# EAGLE design hijack-fram_B (EAGLE 6.2)
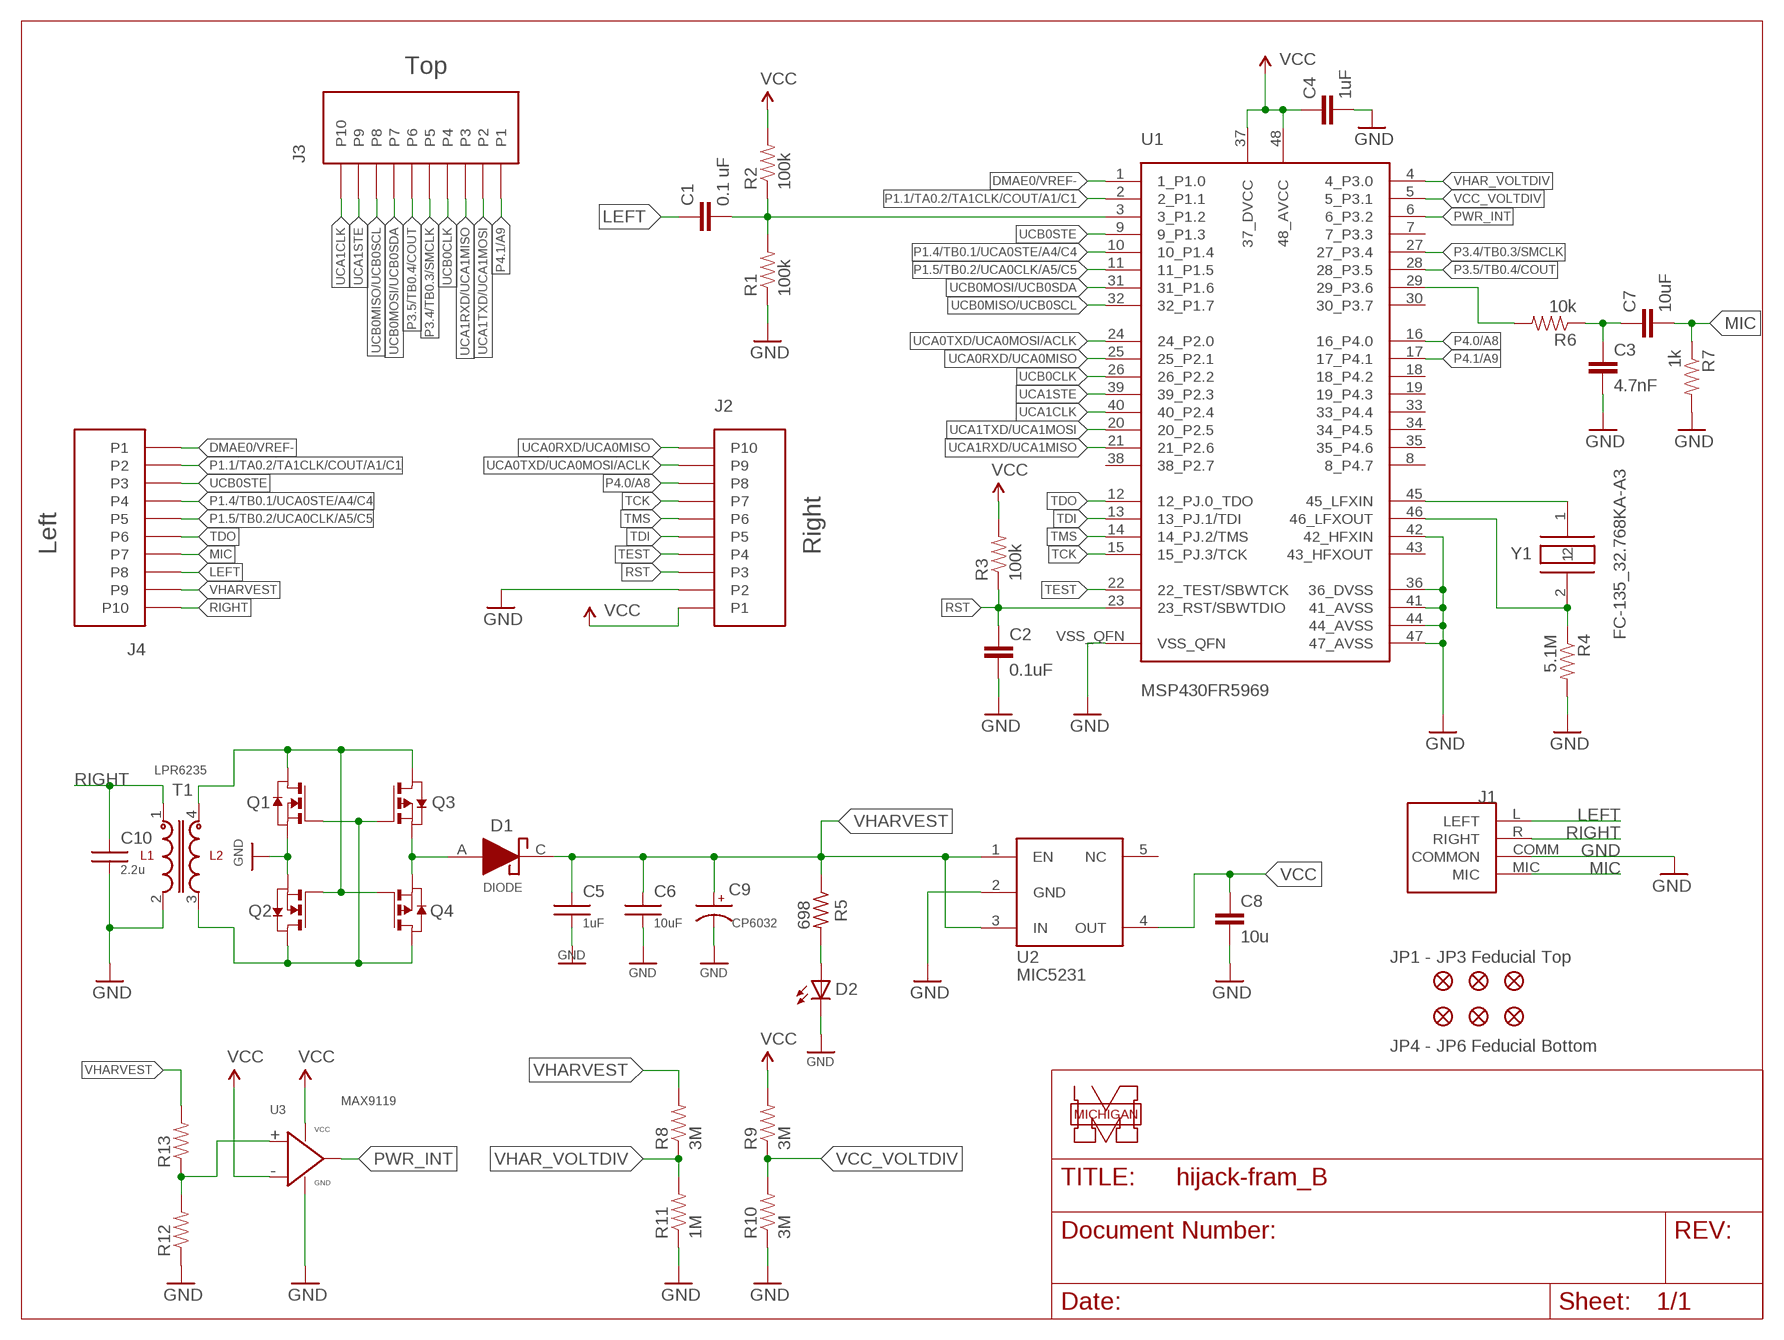
[diagram p0: schematic, sheet 1]

## Parts
C1  0.1 uF  CAP0603-CAP  [0603-CAP]
C2  0.1uF  CAP0603-CAP  [0603-CAP]
C3  4.7nF  CAP0603-CAP  [0603-CAP]
C4  1uF  CAP0603-CAP  [0603-CAP]
C5  1uF  C0603  [C0603]
C6  10uF  C0603  [C0603]
C7  10uF  CAP0603-CAP  [0603-CAP]
C8  10u  C-EUC0603  [C0603]
C9  CP6032  [CT6032]
C10  2.2u  C0603  [C0603]
D1  DIODE  [MINIMELF]
D2  LED0603  [LED-0603]
J1  3.5JACK4CONNSUNSTONE_QUICKTURN  [PLUGBOARDCONNECTOR_SUNSTONE]
J2  HEADER10POS  [10PIN2MMHEADER]
J3  HEADER10POS  [10PIN2MMHEADER]
J4  HEADER10POS  [10PIN2MMHEADER]
JP1  FIDUCIAL1X2  [FIDUCIAL-1X2]
JP2  FIDUCIAL1X2  [FIDUCIAL-1X2]
JP3  FIDUCIAL1X2  [FIDUCIAL-1X2]
JP4  FIDUCIAL1X2  [FIDUCIAL-1X2]
JP5  FIDUCIAL1X2  [FIDUCIAL-1X2]
JP6  FIDUCIAL1X2  [FIDUCIAL-1X2]
Q1  NMOSSOT23  [SOT-23]
Q2  NMOSSOT23  [SOT-23]
Q3  PMOSSOT23  [SOT-23]
Q4  PMOSSOT23  [SOT-23]
R1  100k  RESISTOR0603-RES  [0603-RES]
R2  100k  RESISTOR0603-RES  [0603-RES]
R3  100k  RESISTOR0603-RES  [0603-RES]
R4  5.1M  RESISTOR0603-RES  [0603-RES]
R5  698  R-US_R0603  [R0603]
R6  10k  RESISTOR0603-RES  [0603-RES]
R7  1k  RESISTOR0603-RES  [0603-RES]
R8  3M  RESISTOR0603-RES  [0603-RES]
R9  3M  RESISTOR0603-RES  [0603-RES]
R10  3M  RESISTOR0603-RES  [0603-RES]
R11  1M  RESISTOR0603-RES  [0603-RES]
R12  RESISTOR0603-RES  [0603-RES]
R13  RESISTOR0603-RES  [0603-RES]
T1  LPR6235  [LPR6235]
U1  MSP430FR5969  [RGZ(S-PQFP-N48)]
U2  MIC5231  [SOT23-5]
U3  MAX9119  [SC70-5]
Y1  FC-135_32.768KA-A3  [FC-135]

## Nets
DMAE0/VREF-: J4.P1 U1.1(1_P1.0)
GND: C2.2 C3.2 C4.2 C5.2 C6.2 C8.2 C9.- C10.2 D2.C J1.COMM(COMMON) J2.P2 Q1.2(S) Q2.2(S) R1.1 R4.2 R7.2 R10.1 R11.1 R12.1 T1.2 U1.36(36_DVSS) U1.41(41_AVSS) U1.42(42_HFXIN) U1.44(44_AVSS) U1.47(47_AVSS) U1.VSS_QFN U2.2(GND) U3.2(GND)
LEFT: C1.1 J1.L(LEFT) J4.P8
MIC: C7.2 J1.MIC J4.P7 R7.1
N$1: C1.2 R1.2 R2.1 U1.3(3_P1.2)
N$2: R4.1 U1.46(46_LFXOUT) Y1.2
N$3: R6.2 U1.29(29_P3.6)
N$6: R12.2 R13.1 U3.3(IN+)
N$7: U1.45(45_LFXIN) Y1.1
N$8: Q1.1(D) Q2.3(G) Q3.1(D) Q4.3(G) T1.4
N$9: Q1.3(G) Q2.1(D) Q3.3(G) Q4.1(D) T1.3
N$11: D2.A R5.2
N$12: C3.1 C7.1 R6.1
N$17: D1.A Q3.2(S) Q4.2(S)
P1.1/TA0.2/TA1CLK/COUT/A1/C1: J4.P2 U1.2(2_P1.1)
P1.4/TB0.1/UCA0STE/A4/C4: J4.P4 U1.10(10_P1.4)
P1.5/TB0.2/UCA0CLK/A5/C5: J4.P5 U1.11(11_P1.5)
P3.4/TB0.3/SMCLK: J3.P5 U1.27(27_P3.4)
P3.5/TB0.4/COUT: J3.P6 U1.28(28_P3.5)
P4.0/A8: J2.P8 U1.16(16_P4.0)
P4.1/A9: J3.P1 U1.17(17_P4.1)
PWR_INT: U1.6(6_P3.2) U3.1(OUT)
RIGHT: C10.1 J1.R(RIGHT) J4.P10 T1.1
RST: C2.1 J2.P3 R3.1 U1.23(23_RST/SBWTDIO)
TCK: J2.P7 U1.15(15_PJ.3/TCK)
TDI: J2.P5 U1.13(13_PJ.1/TDI)
TDO: J4.P6 U1.12(12_PJ.0_TDO)
TEST: J2.P4 U1.22(22_TEST/SBWTCK)
TMS: J2.P6 U1.14(14_PJ.2/TMS)
UCA0RXD/UCA0MISO: J2.P10 U1.25(25_P2.1)
UCA0TXD/UCA0MOSI/ACLK: J2.P9 U1.24(24_P2.0)
UCA1CLK: J3.P10 U1.40(40_P2.4)
UCA1RXD/UCA1MISO: J3.P3 U1.21(21_P2.6)
UCA1STE: J3.P9 U1.39(39_P2.3)
UCA1TXD/UCA1MOSI: J3.P2 U1.20(20_P2.5)
UCB0CLK: J3.P4 U1.26(26_P2.2)
UCB0MISO/UCB0SCL: J3.P8 U1.32(32_P1.7)
UCB0MOSI/UCB0SDA: J3.P7 U1.31(31_P1.6)
UCB0STE: J4.P3 U1.9(9_P1.3)
VCC: C4.1 C8.1 J2.P1 R2.2 R3.2 R9.2 U1.37(37_DVCC) U1.48(48_AVCC) U2.4(OUT) U3.4(IN-) U3.5(VCC)
VCC_VOLTDIV: R9.1 R10.2 U1.5(5_P3.1)
VHAR_VOLTDIV: R8.1 R11.2 U1.4(4_P3.0)
VHARVEST: C5.1 C6.1 C9.+ D1.C J4.P9 R5.1 R8.2 R13.2 U2.1(EN) U2.3(IN)
Unconnected: U1.7(7_P3.3) U1.8(8_P4.7) U1.18(18_P4.2) U1.19(19_P4.3) U1.30(30_P3.7) U1.33(33_P4.4) U1.34(34_P4.5) U1.35(35_P4.6) U1.38(38_P2.7) U1.43(43_HFXOUT) U2.5(NC)

## Notes on the sheet
- Top
- Left | Right
- JP1 - JP3 Feducial Top
- JP4 - JP6 Feducial Bottom
- MICHIGAN

## Library data of the parts
C1-C4 C7 = SparkFun:CAP: Capacitor Standard 0603 ceramic capacitor, and 0.1" leaded capacitor.
C5 C6 C10 = umich:C
C8 = rcl:C-EU: CAPACITOR, European symbol
C9 = umich:CP
D1 = umich:DIODE
D2 = umich:LED: LEDs Standard schematic elements and footprints for 5mm, 3mm, 1206, and 0603 sized LEDs. 5mm - Spark Fun Electronics SKU : COM-00529 (and others)
J1 = Thomas:3.5JACK4CONN
J2-J4 = hijack:HEADER10POS: Fits 3M 950510-6102-AR
JP1-JP6 = SparkFun:FIDUCIAL: Fiducial Alignment Points Various fiducial points for machine vision alignment.
Q1 Q2 = zetex:NMOSSOT23: MOS FET
Q3 Q4 = zetex:PMOSSOT23: MOS FET
R1-R4 R6-R13 = SparkFun:RESISTOR: Resistor Basic schematic elements and footprints for 0603, 1206, and PTH 1/10th watt (small) resistors.
R5 = rcl:R-US_: RESISTOR, American symbol
T1 = umich:LPR6235
U1 = hijack:MSP430FR5969
U2 = berkeley-epic:MIC5231
U3 = hijack:MAX9119
Y1 = berkeley-epic:FC-135_32.768KA-A3

## Board
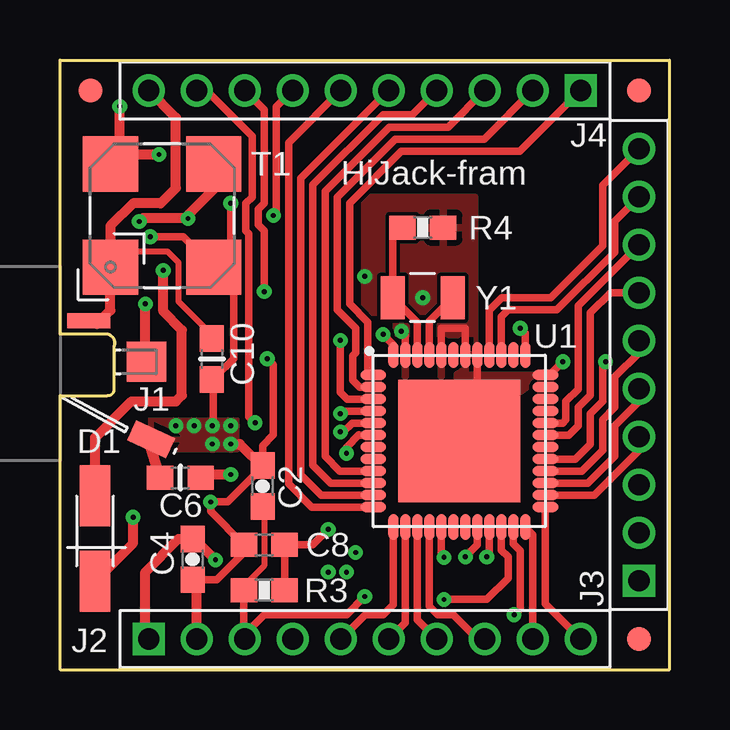
[diagram p1: board, top side]
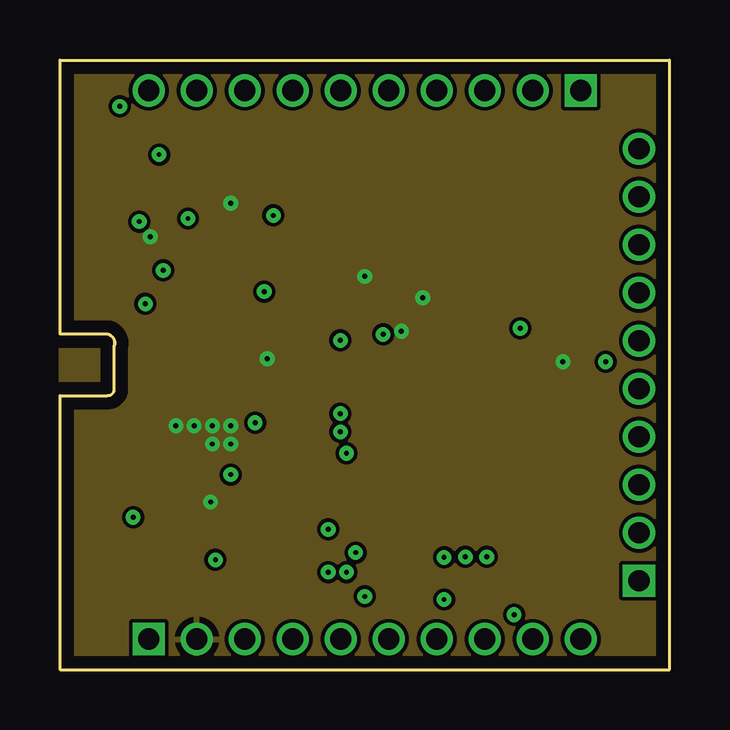
[diagram p2: board, inner layer GND$]
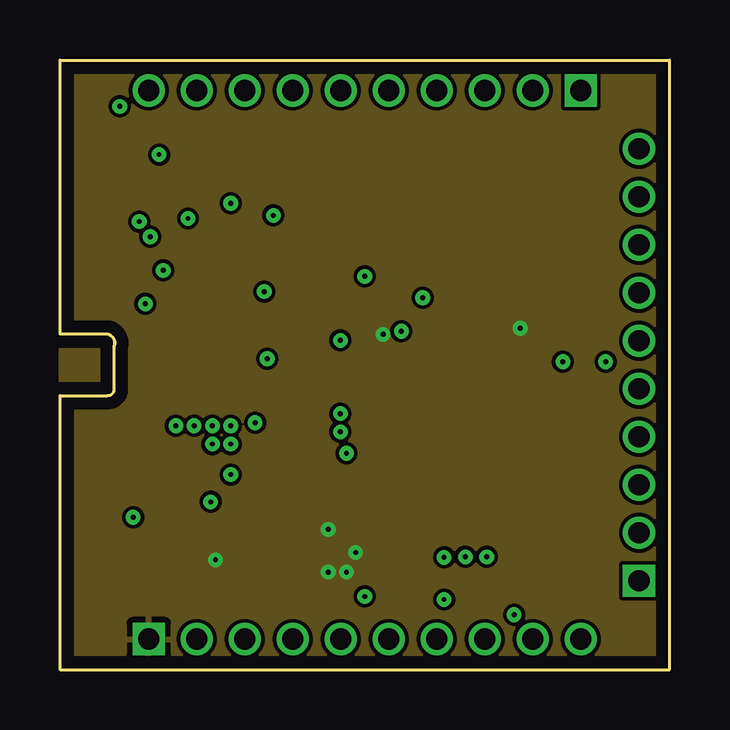
[diagram p3: board, inner layer VCC$]
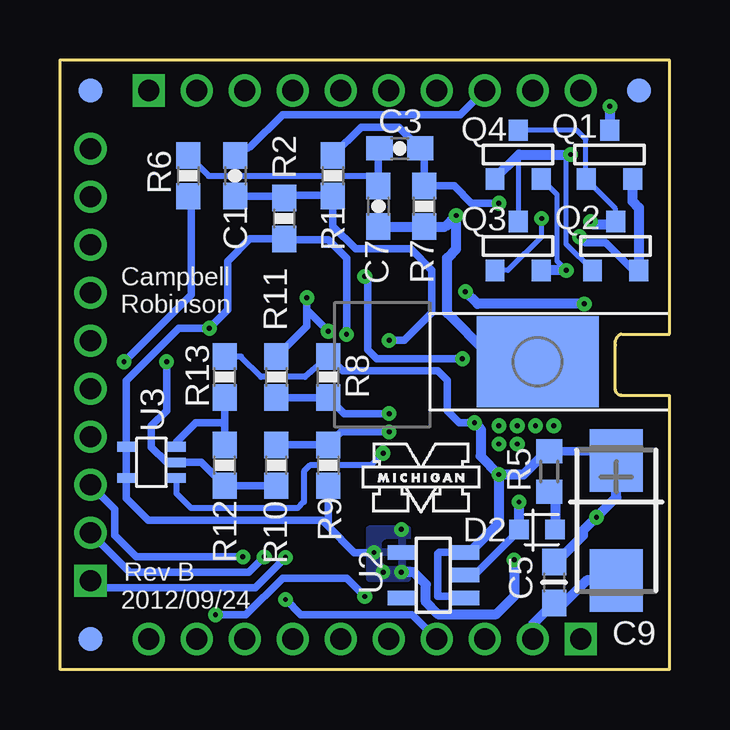
[diagram p4: board, bottom side, seen from below]

Size 25.4 x 25.4 mm. Coordinates in mm from the lower left corner, seen from the top.
Outline: 0,10.87 0,0 25.4,0 25.4,25.4 0,25.4 0,14.47
Copper layers (1*16): Top 0.0178mm / dielectric 59mil / Bottom 0.0178mm
Design rules: minimum track width 6mil, minimum drill 14mil, track to track 6mil, track to pad 6mil, pad to pad 6mil, via to via 6mil, smd to smd 6mil, copper to edge 20mil, drill to drill 16mil, minimum pad ring 8mil, minimum via ring 8mil, stop-mask expansion 3mil, vias tented up to drill 9mil, thermal gap 10mil

### Footprints (pad centres in the part's own frame; a part is rotated, then mirrored left to right if it is on the bottom)
0603-CAP = smd 1.1 x 1: 1 -0.85,0; 2 0.85,0
C0603 = smd 1.1 x 1: 1 -0.85,0; 2 0.85,0
CT6032 = smd 2.6 x 2.2: + -2.5,0; - 2.5,0
MINIMELF = smd 2.54 x 1.27: A -1.778,0; C 1.778,0
LED-0603 = smd 0.8 x 0.8: A 0,-0.75; C 0,0.75
PLUGBOARDCONNECTOR_SUNSTONE = smd 1.778 x 0.914 rotated 155: COMM 3.799,-3.103 | smd 1.651 x 1.651: L 3.601,0.127 | smd 5.08 x 3.81 bottom: MIC 5.501,0.127 | smd 1.778 x 0.635: R 1.201,1.833
10PIN2MMHEADER = drill 0.89 pad 1.346 square: P1 -9,0 | drill 0.89 pad 1.346: P2 -7,0; P3 -5,0; P4 -3,0; P5 -1,0; P6 1,0; P7 3,0; P8 5,0; P9 7,0; P10 9,0
FIDUCIAL-1X2 = smd 1 x 1: 1 0,0
SOT-23 = smd 0.787 x 0.889: 1 0.025,-1.016; 2 -0.94,1.016; 3 0.991,1.016
0603-RES = smd 1.1 x 1: 1 -0.85,0; 2 0.85,0
R0603 = smd 1 x 1.1: 1 -0.85,0; 2 0.85,0
LPR6235 = smd 2.3 x 2.3: 1 -2.15,2.15; 2 -2.15,-2.15; 3 2.15,-2.15; 4 2.15,2.15
RGZ(S-PQFP-N48) = smd 1.075 x 0.42: 1 -3.587,2.75; 2 -3.587,2.25; 3 -3.587,1.75; 4 -3.587,1.25; 5 -3.587,0.75; 6 -3.587,0.25; 7 -3.587,-0.25; 8 -3.587,-0.75; 9 -3.587,-1.25; 10 -3.587,-1.75; 11 -3.587,-2.25; 12 -3.587,-2.75; 25 3.587,-2.75; 26 3.587,-2.25; 27 3.587,-1.75; 28 3.587,-1.25; 29 3.587,-0.75; 30 3.587,-0.25; 31 3.587,0.25; 32 3.587,0.75; 33 3.587,1.25; 34 3.587,1.75; 35 3.587,2.25; 36 3.587,2.75 | smd 0.42 x 1.075: 13 -2.75,-3.587; 14 -2.25,-3.587; 15 -1.75,-3.587; 16 -1.25,-3.587; 17 -0.75,-3.587; 18 -0.25,-3.587; 19 0.25,-3.587; 20 0.75,-3.587; 21 1.25,-3.587; 22 1.75,-3.587; 23 2.25,-3.587; 24 2.75,-3.587; 37 2.75,3.587; 38 2.25,3.587; 39 1.75,3.587; 40 1.25,3.587; 41 0.75,3.587; 42 0.25,3.587; 43 -0.25,3.587; 44 -0.75,3.587; 45 -1.25,3.587; 46 -1.75,3.587; 47 -2.25,3.587; 48 -2.75,3.587 | smd 5.1 x 5.1: VSS_QFN 0,0
SOT23-5 = smd 0.6 x 1.2: 1 -0.95,-1.306; 2 0,-1.306; 3 0.95,-1.306; 4 0.95,1.306; 5 -0.95,1.306
SC70-5 = smd 0.4 x 0.75: 1 -0.65,-1.05; 2 0,-1.05; 3 0.65,-1.05; 4 0.65,1.05; 5 -0.65,1.05
FC-135 = smd 1 x 1.8: 1 -1.25,0; 2 1.25,0

### Placement (x,y rotation side)
C1  18.1,20.58 270 bottom
C2  8.45,7.65 90 top
C3  11.24,21.71 0 bottom
C4  5.52,4.59 270 top
C5  4.81,3.63 270 bottom
C6  5.02,8 180 top
C7  12.13,19.31 270 bottom
C8  8.51,5.21 180 top
C9  2.22,6.22 270 bottom
C10  6.33,12.94 270 top
D1  1.46,5.46 270 top
D2  5.52,5.84 90 bottom
J1  0,12.7 0 top
J2  12.7,1.27 0 top
J3  24.13,12.7 90 top
J4  12.7,24.13 180 top
JP1  24.13,1.27 0 top
JP2  1.27,24.13 0 top
JP3  24.13,24.13 0 top
JP4  1.27,24.13 0 bottom
JP5  24.13,1.27 0 bottom
JP6  24.13,24.13 0 bottom
Q1  2.48,21.46 180 bottom
Q2  2.22,17.65 180 bottom
Q3  6.29,17.65 180 bottom
Q4  6.29,21.46 180 bottom
R1  14.03,20.58 270 bottom
R2  16.06,18.8 270 bottom
R3  8.51,3.3 0 top
R4  15.11,18.41 0 top
R5  5.02,8.25 270 bottom
R6  20.05,20.57 270 bottom
R7  10.22,19.31 90 bottom
R8  14.22,12.19 90 bottom
R9  14.22,8.51 270 bottom
R10  16.38,8.51 90 bottom
R11  16.38,12.19 270 bottom
R12  18.54,8.51 90 bottom
R13  18.54,12.19 90 bottom
T1  4.25,18.92 90 top
U1  16.64,9.53 0 top
U2  9.84,3.93 90 bottom
U3  21.59,8.64 90 bottom
U$2  [UMICH]  12.89,6.35 0 bottom
Y1  15.11,15.49 180 top

### Tracks (layer width: path | path; a pad name or v marks a point on that pad's centre or on a via)
DMAE0/VREF-
  Top 0.305: J4.P1 19.16,21.59 14.22,21.59 12.06,19.43 12.06,15.24 12.83,14.48 12.83,12.5 U1.1
GND  (via drill 0.2)
  Top 0.254: 6.33,10.18 v6.35,10.16 | J1.COMM 3.66,9.6
  Top 0.305: 7.11,17.48 v7.11,19.43 | U1.36 20.4,12.28 v20.95,12.83 | v12.7,16.38 12.7,16.51 | C2.2 8.45,9.34 8.89,9.78 8.89,12.7 v8.64,12.95 | U1.47 14.39,13.93 | U1.44 15.89,14.22 16.89,14.22 U1.42 | U1.VSS_QFN 17.39,10.28 U1.41 | C8.2 6.27,6.59 6.27,6.91 6.35,6.99 | v6.27,6.99 6.35,6.99 | 6.35,6.99 6.99,6.99 8.38,8.38 | 15.88,18.5 R4.2 | v6.35,10.16 6.38,10.19 6.38,12.09 C10.2 6.43,12.19 6.48,12.19 7.24,12.95 7.24,16.13 | T1.2 5.14,18.03 v3.76,18.03 | 7.62,5.08 7.62,4.83 6.54,3.74 C4.2
  Top 0.406: 5.7,3.62 C4.2 5.7,3.57 J2.P2 | 3.66,9.6 C6.2 | T1.2 7.11,17.48 | v7.11,9.4 7.49,9.4 8.51,8.38
  Bottom 0.254: R12.1 18.58,7.66
  Bottom 0.305: D2.C 6.35,5.76 6.35,5.71 8.13,3.93 U2.2 | v7.11,19.43 8.26,19.43 8.98,20.16 R7.2 10.22,21.55 C3.2 11.28,22.61 12.86,22.61 R1.1 14.04,21.78 | v8.64,12.95 12.19,12.95 12.57,13.34 12.57,16.26 v12.7,16.38 | v14.22,14.1 15.11,14.99 v15.11,15.49 15.11,14.31 R11.1 | R10.1 R12.1 19.52,8.64 U3.2 20.95,8.64 21.59,9.27 21.59,10.16 20.95,10.79 v20.95,12.83 | 1.21,16.63 Q2.2 1.52,16.63 2.67,17.78 3.5,17.78 v3.76,18.03
  Bottom 0.406: Q1.2 1.54,19.5 1.28,19.25 Q2.2 1.28,16.71 | C9.- 3.45,3.72 4.59,2.58 C5.2 5.7,1.89 J2.P2 | v6.27,6.99 v6.27,6.98 D2.C
  other vias: 4.83,10.16 5.59,10.16 7.11,10.16 6.35,9.4
  pour Top: 3.05,10.41 7.37,10.41 7.37,9.14 3.05,9.14
  pour Top: 12.7,19.68 12.7,11.43 17.27,11.43 17.27,19.68
  pour GND$: 0,0 25.4,0 25.4,25.4 0,25.4
  pour Top (no thermals): 16.51,12.32 20.32,12.32 19.05,11.43 16.51,11.43
LEFT  (via drill 0.2)
  Top 0.254: 3.56,12.72 3.56,12.78 J1.L
  Top 0.305: J4.P8 8.51,23.32 8.51,19.43 8.26,19.18 8.26,18.54 8.51,18.29 v8.51,15.75
  Top 0.406: 3.56,12.72 v3.56,15.24
  Bottom 0.305: C1.1 17.46,21.78 16.13,23.11 8.72,23.11 J4.P8
  Bottom 0.406: v3.56,15.24 8,15.24 v8.51,15.75
MIC  (via drill 0.2)
  Top 0.305: J4.P7 9.02,23.45 9.02,19.05 v8.89,18.92
  Bottom 0.254: J1.MIC 6.89,12.83 7.01,12.7
  Bottom 0.406: 7.01,12.7 7.49,13.18 7.62,13.21 9.27,14.86 9.27,17.14 8.89,17.53 v8.89,18.92 | 8.93,18.96 v8.89,18.92 | C7.2 R7.1 9.36,18.46 v8.89,18.92
N$1  (via drill 0.2)
  Top 0.305: U1.3 11.97,11.28 11.68,11.56 v11.68,13.72
  Bottom 0.305: C1.2 15.86,19.73 R2.1 15.68,19.77 14.08,19.77 R1.2 14.04,18.48 13.08,17.53 10.79,17.53 9.91,16.64 9.91,14.86 11.05,13.72 v11.68,13.72
N$2
  Top 0.305: U1.46 14.89,14.47 Y1.2 13.86,18.02 R4.1
N$3  (via drill 0.2)
  Top 0.305: U1.29 21.48,8.78 22.1,9.4 22.1,10.67 22.61,11.18 22.61,12.7 v22.73,12.83
  Bottom 0.305: R6.2 19.94,19.61 19.94,15.62 v22.73,12.83
N$6
  Bottom 0.305: 18.6,9.41 R12.2 18.54,10.16 | 18.54,10.16 R13.1 | 18.54,10.16 18.67,10.29 19.74,10.29 20.54,9.49 U3.3
N$7
  Top 0.305: U1.45 15.39,14.52 Y1.1
N$8  (via drill 0.2)
  Top 0.406: v4.13,21.46 2.49,21.46 | 2.49,21.46 T1.4 | 2.49,21.46 v2.49,23.46 v2.49,23.47
  Bottom 0.203: 7.3,20.44 Q4.3 | 3.24,16.63 Q2.3 4.32,17.74 4.32,21.27 v4.13,21.46 | Q3.1 6.29,18.67 6.29,21.46
  Bottom 0.406: Q4.3 7.28,20.47 6.29,21.46 v4.13,21.46 | v2.49,23.47 2.49,22.49 Q1.1
N$9  (via drill 0.2)
  Top 0.406: T1.3 6.4,20.01 5.33,18.94 v5.33,18.8 3.43,18.8 v3.3,18.67
  Bottom 0.203: 3.49,20.44 Q1.3 | 3.49,20.44 2.25,19.2 Q2.1 2.37,18.54 | 3.49,20.44 3.49,22.09 3.87,22.48 Q4.1 | Q3.3 6.73,16.63 5.33,18.03 v5.33,18.8
  Bottom 0.406: 2.37,18.54 3.17,18.54 v3.3,18.67
N$11
  Bottom 0.406: 4.77,5.95 D2.A 4.77,7.4 R5.2
N$12
  Bottom 0.254: 12.22,20.57 C7.1 12.55,20.57 19.2,20.57 R6.1
  Bottom 0.305: C7.1 12.13,21.67 C3.1
N$17  (via drill 0.2)
  Top 0.406: D1.A 1.46,9.66 2.97,11.18 4.83,11.18 5.08,11.43 5.08,14.15 4.3,14.92 v4.3,16.63
  Bottom 0.203: 5.27,20.57 5.35,20.5 Q4.2 4.7,19.8 4.7,17.03 v4.3,16.63
  Bottom 0.406: v4.3,16.63 Q3.2
P1.1/TA0.2/TA1CLK/COUT/A1/C1
  Top 0.305: U1.2 12.48,11.78 12.19,12.06 12.19,13.08 12.32,13.21 12.32,14.22 11.56,14.99 11.56,19.68 13.97,22.1 17.67,22.1 J4.P2
P1.4/TB0.1/UCA0STE/A4/C4
  Top 0.305: U1.10 11.28,7.78 10.54,8.51 10.54,20.19 13.46,23.11 14.68,23.11 J4.P4
P1.5/TB0.2/UCA0CLK/A5/C5
  Top 0.305: U1.11 10.89,7.28 10.03,8.13 10.03,20.46 J4.P5
P3.4/TB0.3/SMCLK
  Top 0.305: J3.P5 24.13,11.18 23.11,10.16 23.11,8.89 22,7.78 U1.27
P3.5/TB0.4/COUT
  Top 0.305: U1.28 21.74,8.28 22.61,9.14 22.61,10.41 23.11,10.92 23.11,12.19 24.13,13.21 J3.P6
P4.0/A8
  Top 0.305: U1.16 15.39,2.65 15.75,2.29 16.38,2.29 17.4,1.27 J2.P8
P4.1/A9  (via drill 0.2)
  Top 0.305: U1.17 15.89,4.79 v16,4.67
  Bottom 0.305: J3.P1 23.83,3.4 17.27,3.4 v16,4.67
PWR_INT  (via drill 0.2)
  Top 0.305: 11.94,9.14 v11.94,9.02 11.94,9.27 12.45,9.78 U1.6
  Bottom 0.254: v11.94,9.02 12.45,8.51 14.99,8.51 15.24,8.26 15.24,6.99 15.49,6.73 19.94,6.73 20.54,7.33 U3.1 20.69,7.99
RIGHT
  Top 0.254: J1.R 1.42,14.53 1.54,14.41 | C10.1 6.33,13.94 4.93,15.34 4.93,16.97 4.47,17.42 2.21,17.42 2.2,17.44
  Top 0.406: T1.1 2.1,17.34 2.2,17.44 | T1.1 2.1,14.97 1.54,14.41 | J4.P10 4.83,23 4.83,20.07 4.19,19.43 3.05,19.43 2.1,18.49 T1.1
RST  (via drill 0.2)
  Top 0.254: C2.1 8.51,6.74 8.51,4.32 7.66,3.47 R3.1
  Top 0.305: v18.92,2.29 19.18,2.54 19.18,4.95 18.89,5.24 U1.23 | R3.1 7.66,1.31 J2.P3 7.7,1.48 8.51,2.29 11.94,2.29 v12.7,3.05
  Bottom 0.305: v18.92,2.29 17.65,2.29 16.13,3.81 13.46,3.81 v12.7,3.05
TCK
  Top 0.305: U1.15 14.89,2.08 J2.P7
TDI
  Top 0.305: U1.13 13.89,2.71 13.46,2.29 12.72,2.29 J2.P5
TDO
  Top 0.305: 11.43,23.86 J4.P6 9.53,21.95 9.53,7.75 10.5,6.78 U1.12
TEST  (via drill 0.2)
  Top 0.305: U1.22 18.39,4.98 18.67,4.7 18.67,3.81 17.78,2.92 v16,2.92
  Bottom 0.305: J2.P4 10.72,2.29 15.37,2.29 v16,2.92
TMS
  Top 0.305: U1.14 14.39,1.96 J2.P6
UCA0RXD/UCA0MISO
  Top 0.305: J2.P10 20.22,2.75 U1.25
UCA0TXD/UCA0MOSI/ACLK
  Top 0.305: J2.P9 19.7,5.62 U1.24
UCA1CLK
  Top 0.305: J3.P10 22.61,20.18 22.61,17.65 20.45,15.49 18.41,15.49 17.89,14.97 U1.40
UCA1RXD/UCA1MISO  (via drill 0.2)
  Top 0.305: U1.21 17.89,4.81 v17.78,4.7
  Bottom 0.305: v17.78,4.7 22.23,4.7 23.11,5.59 23.11,6.68 J3.P3
UCA1STE
  Top 0.305: J3.P9 23.11,18.68 23.11,17.4 20.7,14.99 18.67,14.99 18.39,14.7 U1.39
UCA1TXD/UCA1MOSI  (via drill 0.2)
  Top 0.305: U1.20 17.39,5.2 v16.89,4.7
  Bottom 0.305: J3.P2 22.49,4.06 17.53,4.06 v16.89,4.7
UCB0CLK
  Top 0.305: J3.P4 24.13,9.14 22.26,7.28 U1.26
UCB0MISO/UCB0SCL
  Top 0.305: U1.32 20.94,10.28 21.08,10.41 21.08,11.18 21.59,11.68 21.59,15.16 J3.P8
UCB0MOSI/UCB0SDA
  Top 0.305: U1.31 21.2,9.78 21.59,10.16 21.59,10.92 22.1,11.43 22.1,14.86 22.94,15.7 J3.P7
UCB0STE
  Top 0.305: U1.9 11.66,8.28 11.05,8.89 11.05,19.94 13.72,22.61 16.18,22.61 J4.P3
VCC  (via drill 0.2)
  Top 0.305: v11.18,5.84 10.54,5.21 C8.1 R3.2 | U1.48 13.89,13.54 v13.46,13.97 | U1.37 19.39,14.01 v19.18,14.22
  Top 0.406: J2.P1 3.56,1.41 3.56,4.06 4.94,5.44 C4.1 | 5.46,5.46 5.59,5.46 v6.48,4.57
  Bottom 0.305: 15.9,18.16 R2.2 | v13.46,13.97 13.46,17.14 14.22,17.91 15.88,17.91 | 15.85,17.91 R2.2 | v12.32,4.88 13.13,4.88 14.22,5.97 | R2.2 17.49,17.95 18.41,17.02 18.41,14.99 v19.18,14.22 20.45,14.22 22.64,12.03 U3.4 22.64,8.04 22.61,8 | 14.22,5.97 R9.2 | 14.22,5.97 14.48,6.22 21.72,6.22 22.64,7.15 U3.5
  Bottom 0.406: v11.18,4.06 10.67,4.06 10.16,3.56 10.16,2.82 9.65,2.31 7.21,2.31 6.48,3.05 v6.48,4.57
  other vias: 11.94,4.06
  pour Bottom: 10.92,5.84 10.92,3.81 12.5,3.81 12.5,5.84
  pour VCC$: 0,0 25.4,0 25.4,25.4 0,25.4
VCC_VOLTDIV  (via drill 0.2)
  Top 0.305: U1.5 12.18,10.28 11.81,9.91 v11.68,9.91
  Bottom 0.305: R10.2 R9.1 13.68,9.91 v11.68,9.91
VHAR_VOLTDIV  (via drill 0.2)
  Top 0.305: U1.4 11.79,10.78 v11.68,10.67
  Bottom 0.305: R11.2 16.37,11.33 14.42,11.33 R8.1 13.55,10.67 v11.68,10.67
VHARVEST  (via drill 0.2)
  Top 0.305: v8.13,10.29 7.87,10.54 7.87,18.16 7.75,18.29 7.75,19.43 8,19.68 8,22.23 6.1,24.13 J4.P9
  Top 0.406: D1.C 3.05,5.27 v3.05,6.35 | C6.1 6,8.13 v7.11,8.13
  Bottom 0.254: C9.+ 3.11,9.1 | R8.2 15.2,12.19 17.02,12.19 17.87,13.04 R13.2
  Bottom 0.305: U2.1 8.6,3.05 9.65,3.05 9.65,4.83 9.59,4.88 U2.3 8.32,4.88 | v8.13,10.29 8.76,10.29 9.27,10.79 9.27,12.06 9.65,12.45 13.63,12.45 R8.2
  Bottom 0.356: U2.1 8.6,2.92 | 3.11,9.1 R5.1
  Bottom 0.406: 4.89,4.32 3.62,5.58 3.62,5.78 v3.05,6.35 2.22,7.18 C9.+ | 8.32,4.88 7.11,6.1 v7.11,8.13 | v7.11,8.13 6.1,8.13 5.12,9.1 R5.1 | v7.11,8.13 7.87,8.89 7.87,10.03 v8.13,10.29
  Bottom 0.508: 4.89,4.32 4.93,4.28 C5.1

### Text on the board
tPlace: HiJack-fram
bPlace: Campbell | Robinson | Rev B | 2012/09/24